# EAGLE schematic Midiboy (EAGLE 7.7.0)
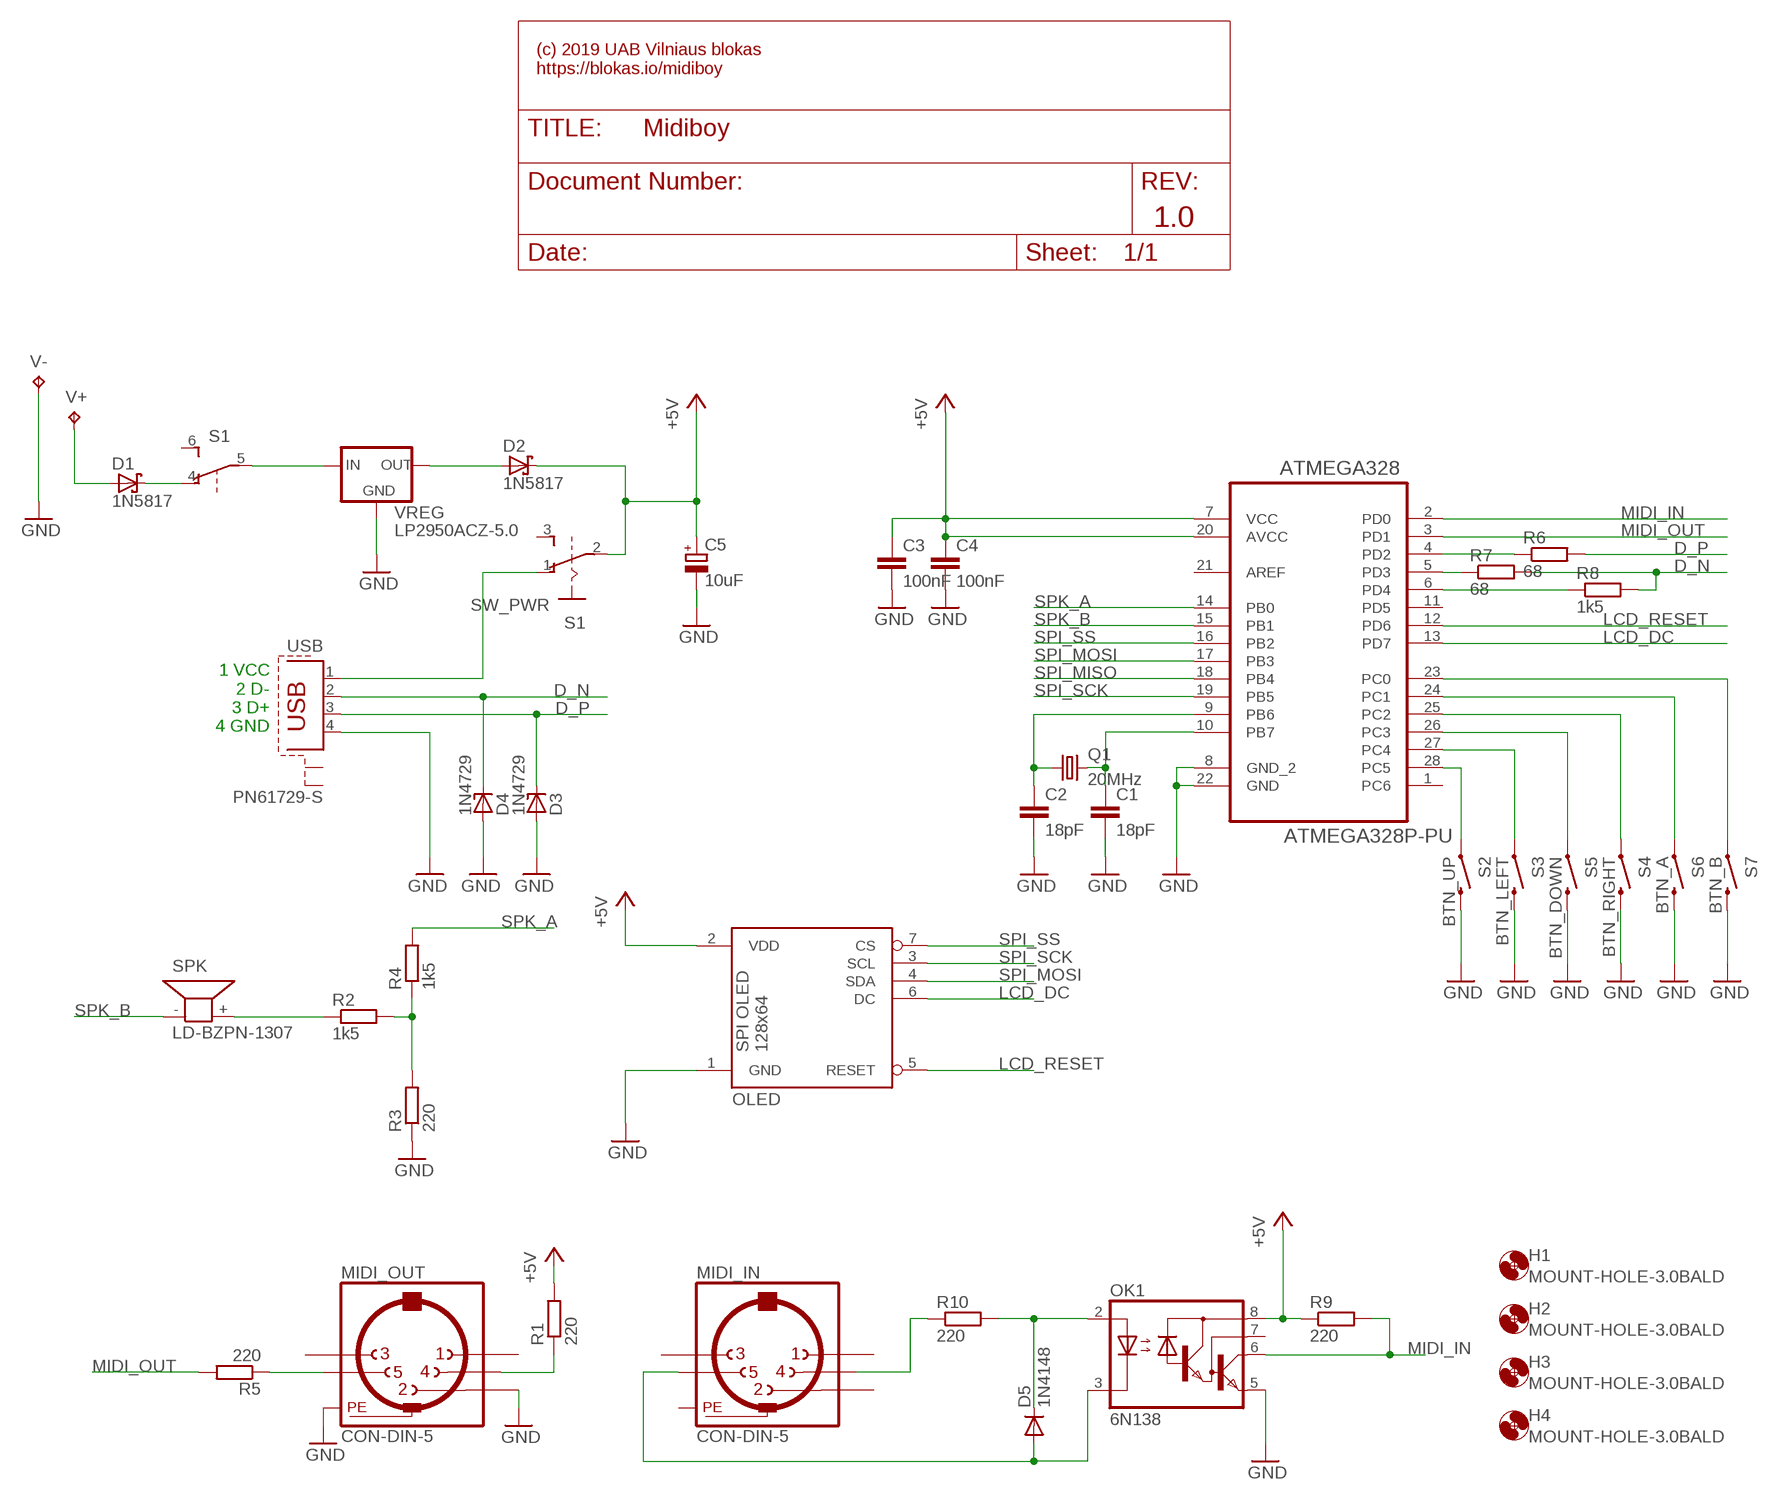
[diagram p0: schematic, sheet 1]

## Parts
ATMEGA328  ATMEGA328P-PU  [DIP254P762X457-28]
C1  18pF  C-EU  [C050-024X044]
C2  18pF  C-EU  [C050-024X044]
C3  100nF  C-EU  [C050-024X044]
C4  100nF  C-EU  [C050-024X044]
C5  10uF  CPOL-EUE2-5  [E2-5]
D1  1N5817  SDIODEDO41-7.6  [DO41-7.6]
D2  1N5817  SDIODEDO41-7.6  [DO41-7.6]
D3  1N4729  ZDIODE  [ZDO41-7.6]
D4  1N4729  ZDIODE  [ZDO41-7.6]
D5  1N4148  DIODEDO35-7  [DO35-7]
H1  MOUNT-HOLE-3.0BALD  [3,0-BALD]
H2  MOUNT-HOLE-3.0BALD  [3,0-BALD]
H3  MOUNT-HOLE-3.0BALD  [3,0-BALD]
H4  MOUNT-HOLE-3.0BALD  [3,0-BALD]
MIDI_IN  CON-DIN-5  [MAB5SH-COMPATIBLE]
MIDI_OUT  CON-DIN-5  [MAB5SH-COMPATIBLE]
OK1  6N138  [DIL08]
OLED  1.54_SPI_OLED1.3  [1.3_SPI_OLED]
Q1  20MHz  CRYSTAL  [HC49/S]
R1  220  R-EU_0204/7  [0204/7]
R2  1k5  R-EU_0204/7  [0204/7]
R3  220  R-EU_0204/7  [0204/7]
R4  1k5  R-EU_0204/7  [0204/7]
R5  220  R-EU_0204/7  [0204/7]
R6  68  R-EU_0204/7  [0204/7]
R7  68  R-EU_0204/7  [0204/7]
R8  1k5  R-EU_0204/7  [0204/7]
R9  220  R-EU_0204/7  [0204/7]
R10  220  R-EU_0204/7  [0204/7]
S1  SW_PWR  A68-A31SMALL  [SS008B02P22]
S2  BTN_UP  SWITCH-MOMENTARY-2PTH  [TACTILE-PTH]
S3  BTN_LEFT  SWITCH-MOMENTARY-2PTH  [TACTILE-PTH]
S4  BTN_RIGHT  SWITCH-MOMENTARY-2PTH_INV  [TACTILE-PTH]
S5  BTN_DOWN  SWITCH-MOMENTARY-2PTH_INV  [TACTILE-PTH]
S6  BTN_A  SWITCH-MOMENTARY-2PTH_INV  [TACTILE-PTH]
S7  BTN_B  SWITCH-MOMENTARY-2PTH_INV  [TACTILE-PTH]
SPK  LD-BZPN-1307  [LD-BZPN-1307]
USB  PN61729-S  [PN61729-S]
V+  TESTPAD  [WIRE-ONESIDE]
V-  TESTPAD  [WIRE-ONESIDE]
VREG  LP2950ACZ-5.0  [TO92]

## Nets
+5V: ATMEGA328.7(VCC) ATMEGA328.20(AVCC) C3.1 C4.1 C5.+ D2.C OK1.8(VCC) OLED.2(VDD) R1.2 R9.1 S1.2(A:P)
_D_N [differential]: ATMEGA328.5(PD3) R7.1
_D_P [differential]: ATMEGA328.4(PD2) R6.1
D_N [differential]: D4.C R7.2 R8.2 USB.2
D_P [differential]: D3.C R6.2 USB.3
GND: ATMEGA328.8(GND_2) ATMEGA328.22(GND) C1.2 C2.2 C3.2 C4.2 C5.- D3.A D4.A MIDI_OUT.2 MIDI_OUT.PE@0(SHIELD) MIDI_OUT.PE@1(SHIELD) MIDI_OUT.PE@2(SHIELD) MIDI_OUT.PE@3(SHIELD) OK1.5(GND) OLED.1(GND) R3.1 S2.3 S3.3 S4.4 S5.4 S6.4 S7.4 USB.4 V-.TP VREG.2(GND)
LCD_DC: ATMEGA328.13(PD7) OLED.6(DC)
LCD_RESET: ATMEGA328.12(PD6) OLED.5(RESET)
MIDI_IN: ATMEGA328.2(PD0) OK1.6(VO) R9.2
MIDI_OUT: ATMEGA328.3(PD1) R5.2
N$1: ATMEGA328.9(PB6) C2.1 Q1.1
N$2: D1.A V+.TP
N$3: ATMEGA328.27(PC4) S3.1
N$4: ATMEGA328.28(PC5) S2.1
N$5: ATMEGA328.25(PC2) S4.2
N$6: ATMEGA328.24(PC1) S6.2
N$7: S1.5(B:P) VREG.3(IN)
N$8: S1.1(A:O) USB.1
N$9: ATMEGA328.6(PD4) R8.1
N$10: ATMEGA328.26(PC3) S5.2
N$11: ATMEGA328.10(PB7) C1.1 Q1.2
N$12: D1.C S1.4(B:O)
N$13: ATMEGA328.23(PC0) S7.2
N$14: D5.A MIDI_IN.5 OK1.3(C)
N$15: D5.C OK1.2(A) R10.2
N$16: MIDI_IN.4 R10.1
N$17: MIDI_OUT.5 R5.1
N$18: MIDI_OUT.4 R1.1
N$19: R2.1 SPK.+
N$20: R2.2 R3.2 R4.1
N$23: D2.A VREG.1(OUT)
SPI_MISO: ATMEGA328.18(PB4)
SPI_MOSI: ATMEGA328.17(PB3) OLED.4(SDA)
SPI_SCK: ATMEGA328.19(PB5) OLED.3(SCL)
SPI_SS: ATMEGA328.16(PB2) OLED.7(CS)
SPK_A: ATMEGA328.14(PB0) R4.2
SPK_B: ATMEGA328.15(PB1) SPK.-
Unconnected: ATMEGA328.1(PC6) ATMEGA328.11(PD5) ATMEGA328.21(AREF) MIDI_IN.1 MIDI_IN.2 MIDI_IN.3 MIDI_IN.PE@0(SHIELD) MIDI_IN.PE@1(SHIELD) MIDI_IN.PE@2(SHIELD) MIDI_IN.PE@3(SHIELD) MIDI_OUT.1 MIDI_OUT.3 OK1.7(VB) S1.3(A:S) S1.6(B:S) USB.S1 USB.S2

## Notes on the sheet
- (c) 2019 UAB Vilniaus blokas
  https://blokas.io/midiboy
- 1.0
- 1 VCC
  2 D-
  3 D+
  4 GND

## Library data of the parts
ATMEGA328 = audio-hw:ATMEGA328P-PU: 8-bit Microcontroller with In-System Programmable Flash; MPN: ATMEGA328P-PU; OC_FARNELL: 1715487; OC_NEWARK: 15R0268; PACKAGE: PDIP-28; SUPPLIER: Atmel
C1-C4 = audio-hw:C-EU
C5 = rcl:CPOL-EU: POLARIZED CAPACITOR, European symbol
D1 D2 = audio-hw:SDIODE
D3 D4 = audio-hw:ZDIODE
D5 = audio-hw:DIODE
H1-H4 = audio-hw:MOUNT-HOLE-3.0
MIDI_IN MIDI_OUT = audio-hw:CON-DIN-5: Female CONNECTOR 5 pins 90 deg. with shield, horizontal (DIN 41524); OC_FARNELL: 809883; OC_NEWARK: unknown
OK1 = audio-hw:6N138: MOTOROLA OPTO COUPLER; MF: VISHAY/TELEFUNKEN; MPN: 6N138; OC_FARNELL: 9860150; OC_NEWARK: 35K5294
OLED = audio-hw:1.54_SPI_OLED
Q1 = audio-hw:CRYSTAL
R1-R10 = rcl:R-EU_: RESISTOR, European symbol
S1 = audio-hw:A68-A31: SLIDING SWITCH Siemens, distributor Buerklin, 11G766
S2-S7 = midi:SWITCH-MOMENTARY-2: Various NO switches- pushbuttons, reed, etc
SPK = audio-hw:LD-BZPN-1307: SPEAKER Source: Buerklin; OC_FARNELL: unknown; OC_NEWARK: unknown
USB = midi:PN61729-S: BERG USB connector; OC_FARNELL: unknown; OC_NEWARK: unknown
V+ V- = audio-hw:TESTPAD
VREG = v-reg:LP2950?*: Source: http://cache.national.com/ds/LP/LP2950.pdf

## Net classes
1 differential: width 0.2 mm